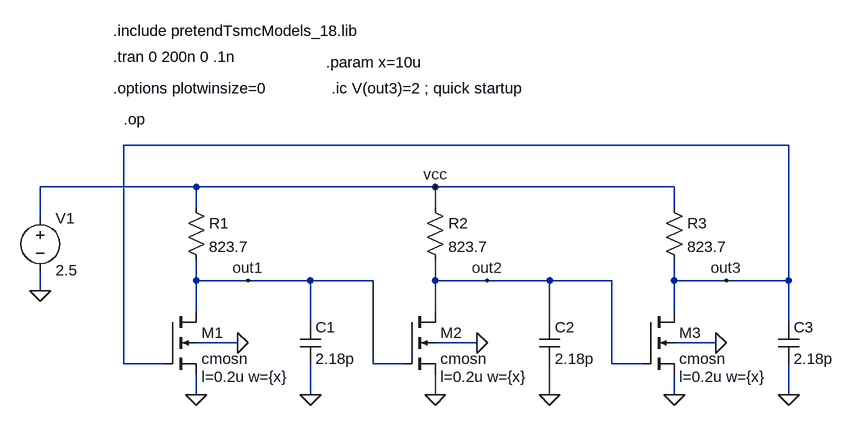
[diagram p0: schematic tsmcInverter_ring_osc.asc]
tsmcInverter_ring_osc.asc, the LTspice schematic file:
Version 4
SHEET 1 1056 680
WIRE 976 -96 -48 -96
WIRE 64 -32 -176 -32
WIRE 432 -32 64 -32
WIRE 800 -32 432 -32
WIRE 64 0 64 -32
WIRE 432 0 432 -32
WIRE 800 0 800 -32
WIRE -176 16 -176 -32
WIRE 64 112 64 80
WIRE 144 112 64 112
WIRE 240 112 144 112
WIRE 336 112 240 112
WIRE 432 112 432 80
WIRE 512 112 432 112
WIRE 608 112 512 112
WIRE 704 112 608 112
WIRE 800 112 800 80
WIRE 880 112 800 112
WIRE 976 112 976 -96
WIRE 976 112 880 112
WIRE -176 128 -176 96
WIRE 64 160 64 112
WIRE 432 160 432 112
WIRE 800 160 800 112
WIRE 240 176 240 112
WIRE 608 176 608 112
WIRE 976 176 976 112
WIRE 128 208 64 208
WIRE 496 208 432 208
WIRE 864 208 800 208
WIRE -48 240 -48 -96
WIRE 16 240 -48 240
WIRE 336 240 336 112
WIRE 384 240 336 240
WIRE 704 240 704 112
WIRE 752 240 704 240
WIRE 64 288 64 256
WIRE 240 288 240 240
WIRE 432 288 432 256
WIRE 608 288 608 240
WIRE 800 288 800 256
WIRE 976 288 976 240
FLAG 64 288 0
FLAG 144 112 out1
FLAG -176 128 0
FLAG 240 288 0
FLAG 128 208 0
FLAG 432 -32 vcc
FLAG 432 288 0
FLAG 512 112 out2
FLAG 608 288 0
FLAG 496 208 0
FLAG 800 288 0
FLAG 880 112 out3
FLAG 976 288 0
FLAG 864 208 0
SYMBOL nmos4 16 160 R0
WINDOW 123 56 100 Left 0
SYMATTR Value2 l=0.2u w={x}
SYMATTR InstName M1
SYMATTR Value cmosn
SYMBOL voltage -176 0 R0
WINDOW 123 0 0 Left 0
WINDOW 39 0 0 Left 0
SYMATTR InstName V1
SYMATTR Value 2.5
SYMBOL res 48 -16 R0
SYMATTR InstName R1
SYMATTR Value 823.7
SYMBOL cap 224 176 R0
SYMATTR InstName C1
SYMATTR Value 2.18p
SYMBOL nmos4 384 160 R0
WINDOW 123 56 100 Left 0
SYMATTR Value2 l=0.2u w={x}
SYMATTR InstName M2
SYMATTR Value cmosn
SYMBOL res 416 -16 R0
SYMATTR InstName R2
SYMATTR Value 823.7
SYMBOL cap 592 176 R0
SYMATTR InstName C2
SYMATTR Value 2.18p
SYMBOL nmos4 752 160 R0
WINDOW 123 56 100 Left 0
SYMATTR Value2 l=0.2u w={x}
SYMATTR InstName M3
SYMATTR Value cmosn
SYMBOL res 784 -16 R0
SYMATTR InstName R3
SYMATTR Value 823.7
SYMBOL cap 960 176 R0
SYMATTR InstName C3
SYMATTR Value 2.18p
TEXT -64 -272 Left 0 !.include pretendTsmcModels_18.lib
TEXT -64 -232 Left 0 !.tran 0 200n 0 .1n
TEXT -64 -184 Left 0 !.options plotwinsize=0
TEXT 264 -224 Left 0 !.param x=10u
TEXT 272 -184 Left 0 !.ic V(out3)=2 ; quick startup
TEXT -48 -136 Left 0 !.op

The netlist it stands for:
* tsmcInverter_ring_osc.asc
M1 out1 out3 0 0 cmosn l=0.2u w={x}
V1 vcc 0 2.5
R1 vcc out1 823.7
C1 out1 0 2.18p
M2 out2 out1 0 0 cmosn l=0.2u w={x}
R2 vcc out2 823.7
C2 out2 0 2.18p
M3 out3 out2 0 0 cmosn l=0.2u w={x}
R3 vcc out3 823.7
C3 out3 0 2.18p
.model NMOS NMOS
.model PMOS PMOS
.lib standard.mos
.include pretendTsmcModels_18.lib
.tran 0 200n 0 .1n
.options plotwinsize=0
.param x=10u
.ic V(out3)=2 ; quick startup
.op
.backanno
.end